# EAGLE design board (EAGLE 9.6.0)
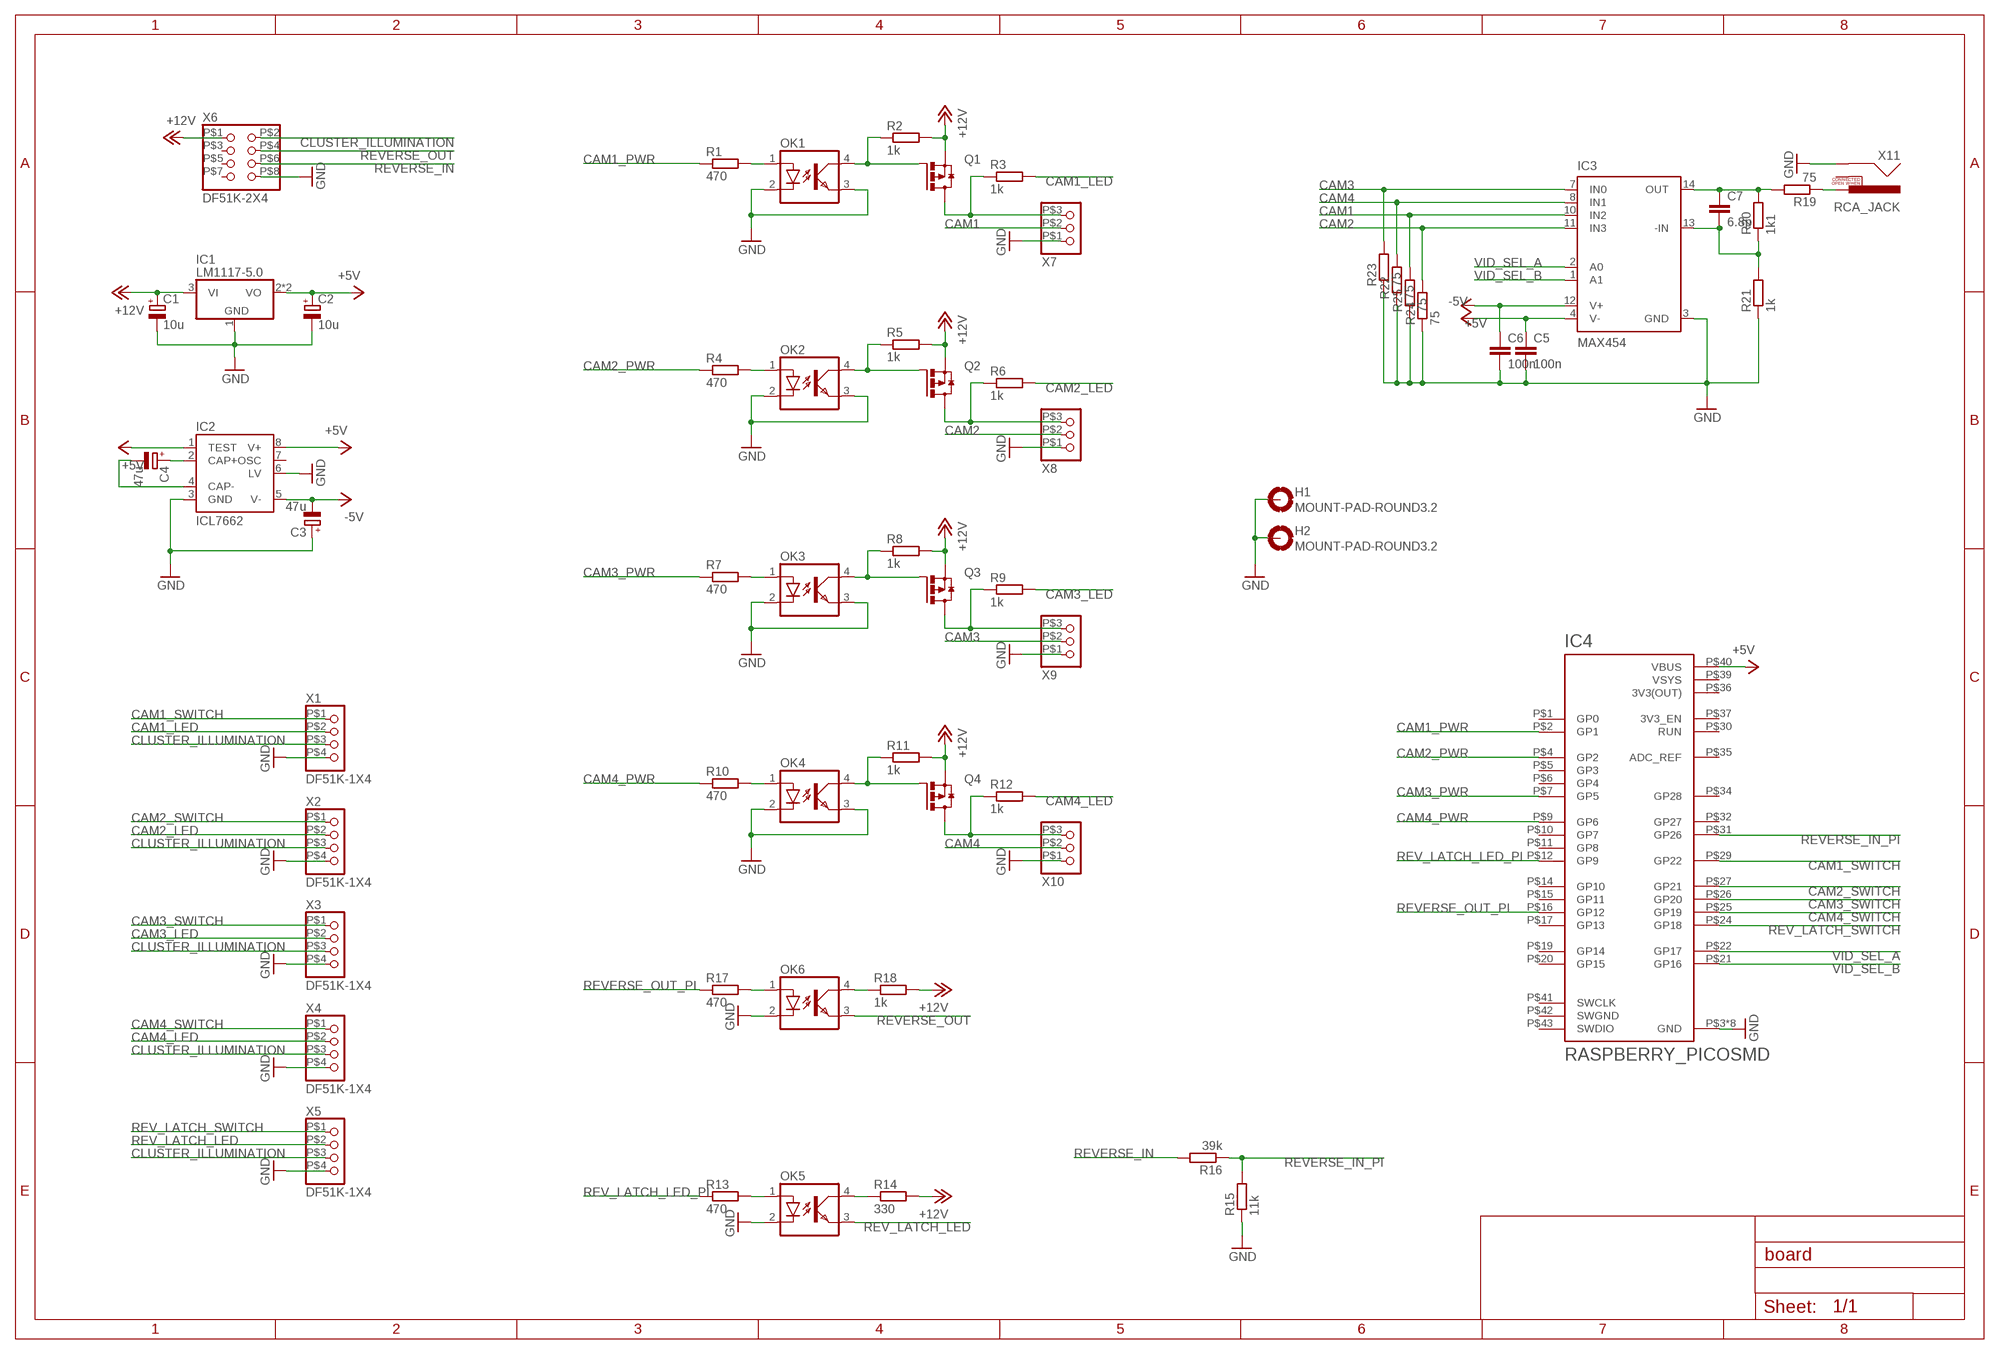
[diagram p0: schematic, sheet 1]

## Parts
C1  10u  CAPACITOR_POL4MM^2  [C_4MM]
C2  10u  CAPACITOR_POL4MM^2  [C_4MM]
C3  47u  CAPACITOR_POL2917  [CT7343]
C4  47u  CAPACITOR_POL2917  [CT7343]
C5  100n  CAPACITOR0805  [C0805]
C6  100n  CAPACITOR0805  [C0805]
C7  6.8p  CAPACITOR0805  [C0805]
H1  MOUNT-PAD-ROUND3.2  [3,2-PAD]
H2  MOUNT-PAD-ROUND3.2  [3,2-PAD]
IC1  LM1117-5.0  LM1117-3.3  [SOT223]
IC2  ICL7662  [SO08]
IC3  MAX454  [DIL14]
IC4  RASPBERRY_PICOSMD  [PICO-PKG-SMD]
OK1  OPTOCOUPLERSO4  [SO04]
OK2  OPTOCOUPLERSO4  [SO04]
OK3  OPTOCOUPLERSO4  [SO04]
OK4  OPTOCOUPLERSO4  [SO04]
OK5  OPTOCOUPLERSO4  [SO04]
OK6  OPTOCOUPLERSO4  [SO04]
Q1  MOSFET_P_CHANNELSOT23  [SOT23]
Q2  MOSFET_P_CHANNELSOT23  [SOT23]
Q3  MOSFET_P_CHANNELSOT23  [SOT23]
Q4  MOSFET_P_CHANNELSOT23  [SOT23]
R1  470  RESISTOR0805  [R0805]
R2  1k  RESISTOR0805  [R0805]
R3  1k  RESISTOR0805  [R0805]
R4  470  RESISTOR0805  [R0805]
R5  1k  RESISTOR0805  [R0805]
R6  1k  RESISTOR0805  [R0805]
R7  470  RESISTOR0805  [R0805]
R8  1k  RESISTOR0805  [R0805]
R9  1k  RESISTOR0805  [R0805]
R10  470  RESISTOR0805  [R0805]
R11  1k  RESISTOR0805  [R0805]
R12  1k  RESISTOR0805  [R0805]
R13  470  RESISTOR0805  [R0805]
R14  330  RESISTOR0805  [R0805]
R15  11k  RESISTOR0805  [R0805]
R16  39k  RESISTOR0805  [R0805]
R17  470  RESISTOR0805  [R0805]
R18  1k  RESISTOR0805  [R0805]
R19  75  RESISTOR0805  [R0805]
R20  1k1  RESISTOR0805  [R0805]
R21  1k  RESISTOR0805  [R0805]
R22  75  RESISTOR0805  [R0805]
R23  75  RESISTOR0805  [R0805]
R24  75  RESISTOR0805  [R0805]
R25  75  RESISTOR0805  [R0805]
X1  DF51K-1X4  [DF51K-1X4]
X2  DF51K-1X4  [DF51K-1X4]
X3  DF51K-1X4  [DF51K-1X4]
X4  DF51K-1X4  [DF51K-1X4]
X5  DF51K-1X4  [DF51K-1X4]
X6  DF51K-2X4  [DF51K-2X4]
X7  JST_XH_1X3  [JST_XH_1X3]
X8  JST_XH_1X3  [JST_XH_1X3]
X9  JST_XH_1X3  [JST_XH_1X3]
X10  JST_XH_1X3  [JST_XH_1X3]
X11  RCA_JACK  [RCA_JACK]

## Nets
+5V: C2.+ C6.1 IC1.2(VO) IC1.4(VO) IC2.1(TEST) IC2.8(V+) IC3.12(V+) IC4.P$40(VBUS)
+12V: C1.+ IC1.3(VI) Q1.2(S) Q2.2(S) Q3.2(S) Q4.2(S) R2.2 R5.2 R8.2 R11.2 R14.2 R18.2 X6.P$1
-5V: C3.- C5.1 IC2.5(V-) IC3.4(V-)
CAM1: IC3.10(IN2) R25.2 X7.P$2
CAM1_LED: R3.2 X1.P$2
CAM1_PWR: IC4.P$2(GP1) R1.1
CAM1_SWITCH: IC4.P$29(GP22) X1.P$1
CAM2: IC3.11(IN3) R24.2 X8.P$2
CAM2_LED: R6.2 X2.P$2
CAM2_PWR: IC4.P$4(GP2) R4.1
CAM2_SWITCH: IC4.P$27(GP21) X2.P$1
CAM3: IC3.7(IN0) R23.2 X9.P$2
CAM3_LED: R9.2 X3.P$2
CAM3_PWR: IC4.P$7(GP5) R7.1
CAM3_SWITCH: IC4.P$26(GP20) X3.P$1
CAM4: IC3.8(IN1) R22.2 X10.P$2
CAM4_LED: R12.2 X4.P$2
CAM4_PWR: IC4.P$9(GP6) R10.1
CAM4_SWITCH: IC4.P$25(GP19) X4.P$1
CLUSTER_ILLUMINATION: X1.P$3 X2.P$3 X3.P$3 X4.P$3 X5.P$3 X6.P$2
GND: C1.- C2.- C3.+ C5.2 C6.2 H1.B3,2(MOUNT) H1.P$1(MOUNT) H1.P$2(MOUNT) H1.P$3(MOUNT) H1.P$4(MOUNT) H1.P$5(MOUNT) H1.P$6(MOUNT) H1.P$7(MOUNT) H1.P$8(MOUNT) H2.B3,2(MOUNT) H2.P$1(MOUNT) H2.P$2(MOUNT) H2.P$3(MOUNT) H2.P$4(MOUNT) H2.P$5(MOUNT) H2.P$6(MOUNT) H2.P$7(MOUNT) H2.P$8(MOUNT) IC1.1(GND) IC2.3(GND) IC2.6(LV) IC3.3(GND) IC4.P$3(GND) IC4.P$8(GND) IC4.P$13(GND) IC4.P$18(GND) IC4.P$23(GND) IC4.P$28(GND) IC4.P$33(GND) IC4.P$38(GND) OK1.2(C) OK1.3(EMIT) OK2.2(C) OK2.3(EMIT) OK3.2(C) OK3.3(EMIT) OK4.2(C) OK4.3(EMIT) OK5.2(C) OK6.2(C) R15.1 R21.1 R22.1 R23.1 R24.1 R25.1 X1.P$4 X2.P$4 X3.P$4 X4.P$4 X5.P$4 X6.P$8 X7.P$1 X8.P$1 X9.P$1 X10.P$1 X11.1(SHELL)
N$1: C4.+ IC2.2(CAP+)
N$2: C4.- IC2.4(CAP-)
N$3: OK1.1(A) R1.2
N$4: OK1.4(COL) Q1.1(G) R2.1
N$5: Q1.3(D) R3.1 X7.P$3
N$6: OK2.1(A) R4.2
N$7: OK2.4(COL) Q2.1(G) R5.1
N$8: Q2.3(D) R6.1 X8.P$3
N$9: OK3.1(A) R7.2
N$10: OK3.4(COL) Q3.1(G) R8.1
N$11: Q3.3(D) R9.1 X9.P$3
N$12: OK4.1(A) R10.2
N$13: C7.1 IC3.14(OUT) R19.2 R20.2
N$14: R19.1 X11.3(PIN)
N$15: C7.2 IC3.13(-IN) R20.1 R21.2
N$16: OK4.4(COL) Q4.1(G) R11.1
N$17: Q4.3(D) R12.1 X10.P$3
N$18: OK6.1(A) R17.2
N$19: OK6.4(COL) R18.1
N$20: OK5.1(A) R13.2
N$21: OK5.4(COL) R14.1
REV_LATCH_LED: OK5.3(EMIT) X5.P$2
REV_LATCH_LED_PI: IC4.P$12(GP9) R13.1
REV_LATCH_SWITCH: IC4.P$24(GP18) X5.P$1
REVERSE_IN: R16.2 X6.P$6
REVERSE_IN_PI: IC4.P$31(GP26) R15.2 R16.1
REVERSE_OUT: OK6.3(EMIT) X6.P$4
REVERSE_OUT_PI: IC4.P$16(GP12) R17.1
VID_SEL_A: IC3.2(A0) IC4.P$22(GP17)
VID_SEL_B: IC3.1(A1) IC4.P$21(GP16)
Unconnected: IC2.7(OSC) IC4.P$1(GP0) IC4.P$5(GP3) IC4.P$6(GP4) IC4.P$10(GP7) IC4.P$11(GP8) IC4.P$14(GP10) IC4.P$15(GP11) IC4.P$17(GP13) IC4.P$19(GP14) IC4.P$20(GP15) IC4.P$30(RUN) IC4.P$32(GP27) IC4.P$34(GP28) IC4.P$35(ADC_REF) IC4.P$37(3V3_EN) IC4.P$41(SWCLK) IC4.P$43(SWDIO) X6.P$3 X6.P$5 X6.P$7 X11.4(SWITCH)

## Power pins joined to a net without a drawn wire
3V3(OUT): IC4.P$36(3V3(OUT))
SWGND: IC4.P$42(SWGND)
VSYS: IC4.P$39(VSYS)

## Library data of the parts
C1-C4 = SMD:CAPACITOR_POL
C5-C7 = SMD:CAPACITOR
H1 H2 = THT:MOUNT-PAD-ROUND: MOUNTING PAD, round
IC1 = SMD:LM1117-3.3
IC2 = SMD:ICL7662
IC3 = THT:MAX454
IC4 = SMD:RASPBERRY_PICO: Raspberry Pi Pico
OK1-OK6 = SMD:OPTOCOUPLER
Q1-Q4 = SMD:MOSFET_P_CHANNEL
R1-R25 = SMD:RESISTOR
X1-X5 = THT:DF51K-1X4
X6 = THT:DF51K-2X4
X7-X10 = THT:JST_XH_1X3
X11 = THT:RCA_JACK

## Board
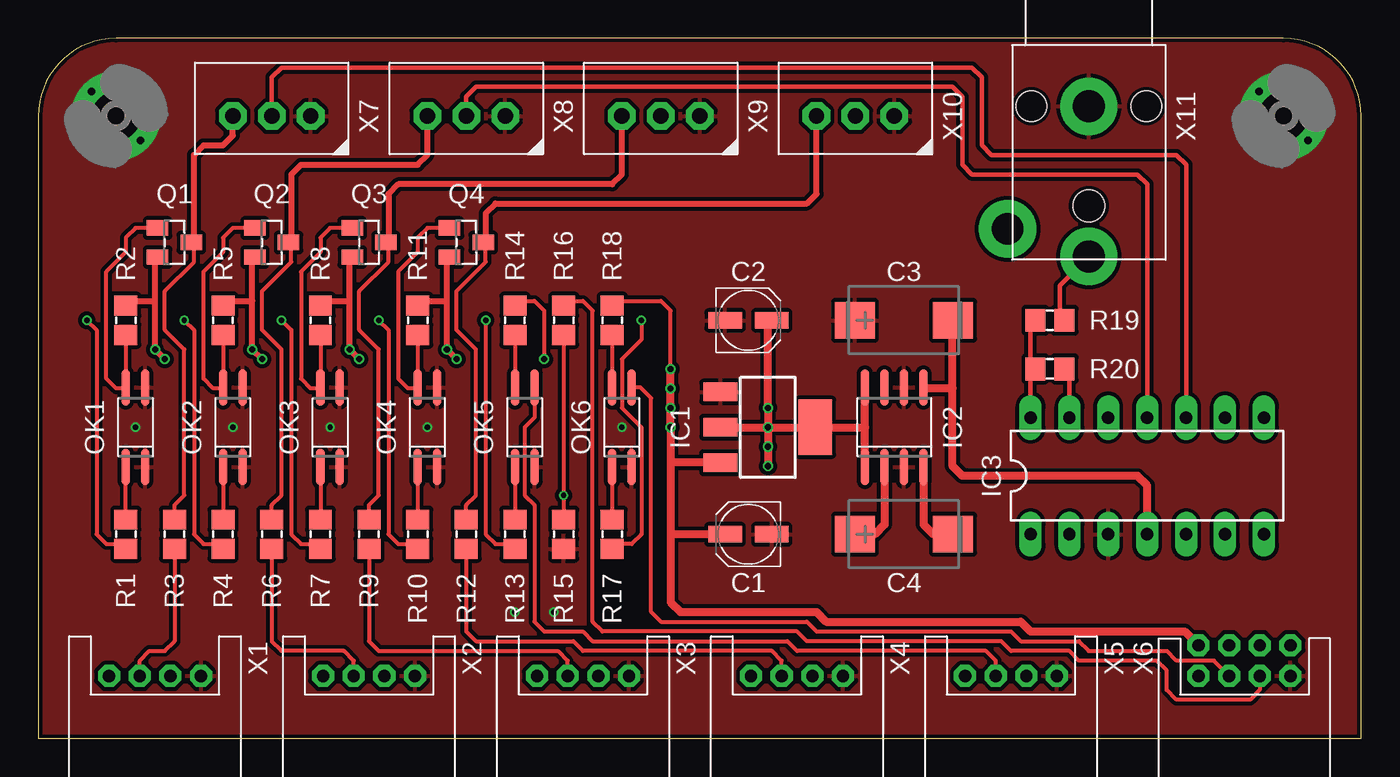
[diagram p1: board, top side]
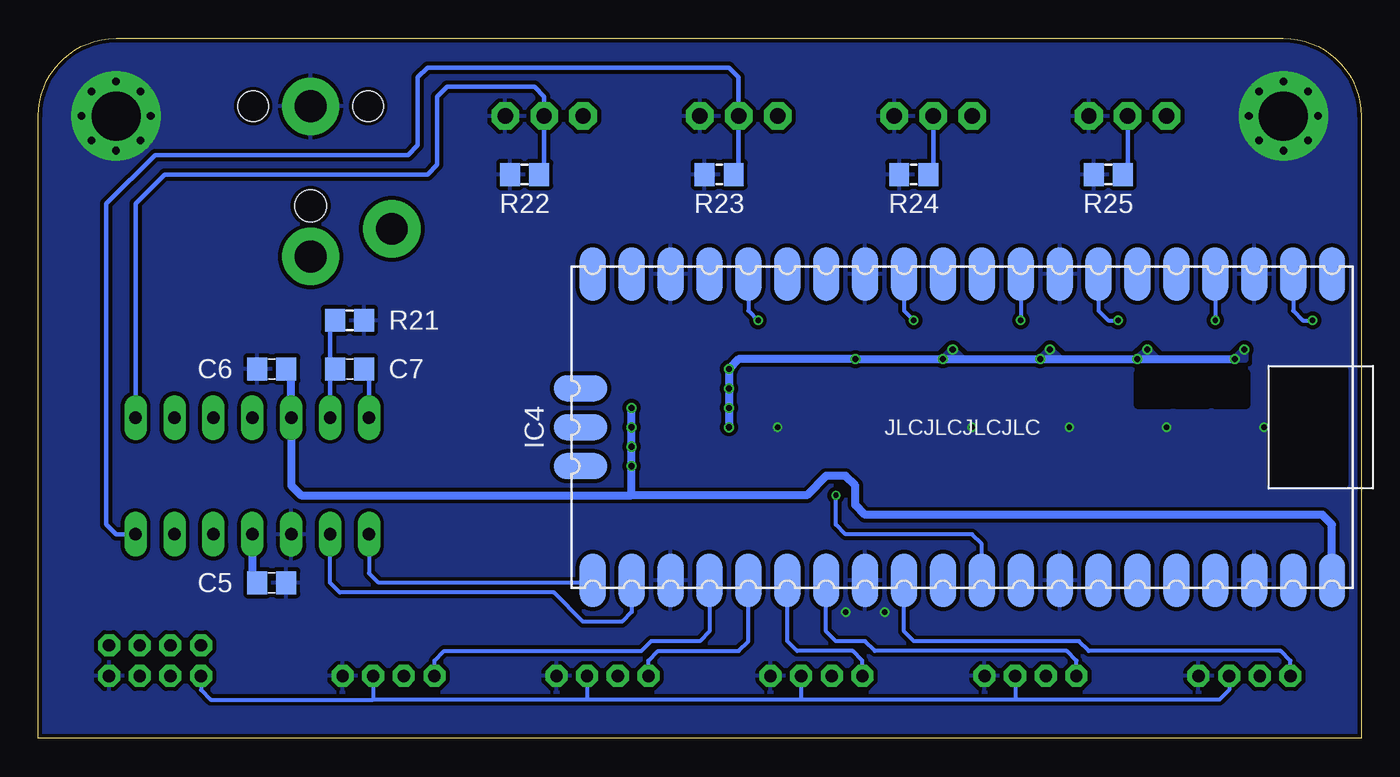
[diagram p2: board, bottom side, seen from below]

Size 86.36 x 45.72 mm. Coordinates in mm from the lower left corner, seen from the top.
Outline: 0,0 86.36,0 86.36,40.64 arc90 81.28,45.72 5.08,45.72 arc90 0,40.64 0,0
Copper layers (1*16): Top 0.035mm / dielectric 1.6mm / Bottom 0.035mm
Design rules "jlc *": minimum track width 6mil, minimum drill 0.3mm, track to track 6mil, track to pad 6mil, pad to pad 6mil, via to via 6mil, smd to smd 6mil, copper to edge 0.2mm, drill to drill 6mil, minimum pad ring 10mil, minimum via ring 5mil, stop-mask expansion 4mil, vias tented up to drill 20mil, thermal gap 10mil

### Footprints (pad centres in the part's own frame; a part is rotated, then mirrored left to right if it is on the bottom)
C_4MM = smd 2.184 x 1.067: + 1.524,0; - -1.524,0
CT7343 = smd 2.6 x 2.4: + -3.2,0; - 3.2,0
C0805 = smd 1.3 x 1.5: 1 -0.95,0; 2 0.95,0
3,2-PAD = drill 3.2 pad 5.842: B3,2 0,0 | drill 0.5: P$1 0,2.261; P$2 0,-2.261; P$3 2.261,0; P$4 -2.261,0; P$5 -1.598,1.598; P$6 1.598,1.598; P$7 -1.598,-1.598; P$8 1.598,-1.598
SOT223 = smd 1.219 x 2.235: 1 -2.311,-3.099; 2 0,-3.099; 3 2.311,-3.099 | smd 3.6 x 2.2: 4 0,3.099
SO08 = smd 0.559 x 2.388: 1 -1.905,-2.6; 2 -0.635,-2.6; 3 0.635,-2.6; 4 1.905,-2.6; 5 1.905,2.6; 6 0.635,2.6; 7 -0.635,2.6; 8 -1.905,2.6
DIL14 = drill 0.813 long: 1 -7.62,-3.81; 2 -5.08,-3.81; 3 -2.54,-3.81; 4 0,-3.81; 5 2.54,-3.81; 6 5.08,-3.81; 7 7.62,-3.81; 8 7.62,3.81; 9 5.08,3.81; 10 2.54,3.81; 11 0,3.81; 12 -2.54,3.81; 13 -5.08,3.81; 14 -7.62,3.81
PICO-PKG-SMD = smd 3.5 x 1.7: P$1 -10,24.13; P$2 -10,21.59; P$3 -10,19.05; P$4 -10,16.51; P$5 -10,13.97; P$6 -10,11.43; P$7 -10,8.89; P$8 -10,6.35; P$9 -10,3.81; P$10 -10,1.27; P$11 -10,-1.27; P$12 -10,-3.81; P$13 -10,-6.35; P$14 -10,-8.89; P$15 -10,-11.43; P$16 -10,-13.97; P$17 -10,-16.51; P$18 -10,-19.05; P$19 -10,-21.59; P$20 -10,-24.13; P$21 10,-24.13; P$22 10,-21.59; P$23 10,-19.05; P$24 10,-16.51; P$25 10,-13.97; P$26 10,-11.43; P$27 10,-8.89; P$28 10,-6.35; P$29 10,-3.81; P$30 10,-1.27; P$31 10,1.27; P$32 10,3.81; P$33 10,6.35; P$34 10,8.89; P$35 10,11.43; P$36 10,13.97; P$37 10,16.51; P$38 10,19.05; P$39 10,21.59; P$40 10,24.13 | smd 1.7 x 3.5: P$41 -2.54,-24.925; P$42 0,-24.925; P$43 2.54,-24.925
SO04 = smd 0.559 x 2.388: 1 -0.635,-2.6; 2 0.635,-2.6; 3 0.635,2.6; 4 -0.635,2.6
SOT23 = smd 1 x 1.4: 1 -0.95,-1.1; 2 0.95,-1.1; 3 0,1.1
R0805 = smd 1.3 x 1.5: 1 -0.95,0; 2 0.95,0
DF51K-1X4 = drill 0.8 octagon: P$1 -3,0; P$2 -1,0; P$3 1,0; P$4 3,0
DF51K-2X4 = drill 0.8 octagon: P$1 -3,1; P$2 -3,-1; P$3 -1,1; P$4 -1,-1; P$5 1,1; P$6 1,-1; P$7 3,1; P$8 3,-1
JST_XH_1X3 = drill 1 octagon: P$1 -2.54,0; P$2 0,0; P$3 2.54,0
RCA_JACK = drill 2.08: 1 0,0; 3 9.8,0; 4 8,-5.3 | hole 2.08: 6.5,0 | hole 1.98: 0,3.745; 0,-3.745

### Placement (x,y rotation side)
C1  46.35,13.34 180 top
C2  46.35,27.3 0 top
C3  56.52,27.3 0 top
C4  56.52,13.34 0 top
C5  71.12,10.16 0 bottom
C6  71.12,24.13 180 bottom
C7  66.04,24.13 180 bottom
H1  5.08,40.64 0 top
H2  81.28,40.64 0 top
IC1  47.62,20.32 270 top
IC2  55.88,20.32 0 top
IC3  72.39,17.14 0 top
IC4  26.04,20.32 270 bottom
OK1  6.35,20.32 0 top
OK2  12.7,20.32 0 top
OK3  19.05,20.32 0 top
OK4  25.4,20.32 0 top
OK5  31.75,20.32 0 top
OK6  38.1,20.32 0 top
Q1  8.89,32.38 270 top
Q2  15.24,32.38 270 top
Q3  21.59,32.38 270 top
Q4  27.94,32.38 270 top
R1  5.71,13.34 90 top
R2  5.71,27.3 90 top
R3  8.89,13.34 270 top
R4  12.06,13.34 90 top
R5  12.06,27.3 90 top
R6  15.24,13.34 270 top
R7  18.41,13.34 90 top
R8  18.41,27.3 90 top
R9  21.59,13.34 270 top
R10  24.77,13.34 90 top
R11  24.77,27.3 90 top
R12  27.94,13.34 270 top
R13  31.11,13.34 90 top
R14  31.11,27.3 90 top
R15  34.29,13.34 90 top
R16  34.29,27.3 90 top
R17  37.47,13.34 90 top
R18  37.47,27.3 90 top
R19  66.04,27.3 180 top
R20  66.04,24.13 180 top
R21  66.04,27.3 180 bottom
R22  54.61,36.83 0 bottom
R23  41.91,36.83 0 bottom
R24  29.21,36.83 0 bottom
R25  16.51,36.83 0 bottom
X1  7.62,4.08 0 top
X2  21.59,4.08 0 top
X3  35.56,4.08 0 top
X4  49.53,4.08 0 top
X5  63.5,4.08 0 top
X6  78.74,5.08 0 top
X7  15.24,40.64 180 top
X8  27.94,40.64 180 top
X9  40.64,40.64 180 top
X10  53.34,40.64 180 top
X11  68.58,41.27 270 top

### Tracks (layer width: path | path; a pad name or v marks a point on that pad's centre or on a via)
+5V  (via drill 0.4)
  Top 0.508: C2.+ 47.62,27.05 v47.62,21.59 v47.62,20.32 | IC1.2 v47.62,20.32 | v47.62,20.32 IC1.4 53.98,20.32 | v47.62,20.32 v47.62,19.05 v47.62,17.78 | 53.98,20.32 IC2.8 | IC2.1 53.98,20.32
  Bottom 0.508: IC4.P$40 1.91,13.97 2.54,14.61 32.38,14.61 33.02,15.24 33.02,16.51 33.66,17.14 34.92,17.14 36.2,15.88 47.62,15.88 | 47.62,15.88 v47.62,21.59 | C6.1 69.85,23.81 IC3.12 69.85,16.51 69.22,15.88 47.62,15.88
+12V  (via drill 0.4)
  Top 0.254: R18.2 37.78,28.25 38.1,28.57 40.64,28.57 41.27,27.94 v41.27,24.13 | R14.2 31.43,28.57 32.38,28.57 33.02,27.94 v33.02,24.77
  Top 0.406: Q4.2 26.67,31.27 26.67,28.57 | v27.3,24.77 v26.67,25.4 26.67,28.57 | R11.2 25.08,28.25 25.4,28.57 26.67,28.57 | Q3.2 20.32,31.27 20.32,28.57 | v20.95,24.77 v20.32,25.4 20.32,28.57 | R8.2 18.73,28.57 20.32,28.57 | Q2.2 13.97,31.27 13.97,28.57 | v14.61,24.77 v13.97,25.4 13.97,28.57 | R5.2 12.38,28.57 13.97,28.57 | Q1.2 7.62,31.27 7.62,28.57 | R2.2 6.04,28.57 7.62,28.57 | 7.62,28.57 v7.62,25.4 v8.26,24.77
  Top 0.508: X6.P$1 74.83,6.99 64.77,6.99 64.14,7.62 51.44,7.62 50.8,8.26 41.91,8.26 41.27,8.89 41.27,13.34 | v41.27,24.13 v41.27,22.86 v41.27,21.59 v41.27,20.32 41.27,18.01 | 41.27,18.01 41.27,13.34 | IC1.3 41.27,18.01 | C1.+ 41.27,13.34
  Bottom 0.508: v8.26,24.77 v14.61,24.77 v20.95,24.77 v27.3,24.77 v33.02,24.77 40.64,24.77 v41.27,24.13 v41.27,22.86 v41.27,21.59 v41.27,20.32
  pour Bottom (isolate 0.254): 7.62,25.4 7.62,24.77 8.26,24.77
  pour Bottom (isolate 0.254): 13.34,24.77 13.97,25.4 14.61,24.77
  pour Bottom (isolate 0.254): 19.68,24.77 20.32,25.4 20.95,24.77
  pour Bottom (isolate 0.254): 26.04,24.77 26.67,25.4 27.3,24.77
-5V
  Top 0.508: IC3.4 72.39,16.51 71.75,17.14 60.33,17.14 59.69,17.78 59.69,22.86 | C3.- 59.69,27.28 59.69,22.86 | IC2.5 57.84,22.86 59.69,22.86
  Bottom 0.254: 72.39,10.48 C5.1
  Bottom 0.508: IC3.4 72.39,10.48
CAM1
  Top 0.305: X7.P$2 15.24,43.18 15.88,43.81 60.96,43.81 61.59,43.18 61.59,38.73 62.23,38.1 74.3,38.1 74.93,37.47 IC3.10
  Bottom 0.254: 15.24,37.15 R25.2
  Bottom 0.305: X7.P$2 15.24,37.15
CAM1_LED
  Top 0.254: R3.2 8.89,6.35 8.26,5.71 7.25,5.71 6.62,5.08 X1.P$2
CAM1_PWR  (via drill 0.35)
  Top 0.254: v3.17,27.3 3.81,26.67 3.81,13.34 4.45,12.7 6.03,12.7 R1.1
  Bottom 0.254: IC4.P$2 4.45,27.94 3.81,27.3 v3.17,27.3
CAM1_SWITCH
  Bottom 0.254: X1.P$1 4.62,5.08 5.25,5.71 17.78,5.71 18.41,6.35 29.21,6.35 29.84,6.99 IC4.P$29
CAM2
  Top 0.305: X8.P$2 27.94,41.91 28.57,42.55 59.69,42.55 60.33,41.91 60.33,37.47 60.96,36.83 71.75,36.83 72.39,36.2 IC3.11
  Bottom 0.254: 27.94,37.15 R24.2
  Bottom 0.305: X8.P$2 27.94,37.15
CAM2_LED
  Top 0.254: R6.2 15.24,6.35 15.88,5.71 19.95,5.71 20.59,5.08 X2.P$2
CAM2_PWR  (via drill 0.35)
  Top 0.254: v9.53,27.3 10.16,26.67 10.16,13.34 10.79,12.7 12.38,12.7 R4.1
  Bottom 0.254: IC4.P$4 v9.53,27.3
CAM2_SWITCH
  Bottom 0.254: X2.P$1 18.59,5.08 19.23,5.71 31.75,5.71 32.38,6.35 34.29,6.35 34.92,6.99 IC4.P$27
CAM3
  Bottom 0.254: 40.64,36.83 R23.2
  Bottom 0.305: 40.64,36.83 X9.P$2 40.64,43.18 41.27,43.81 60.96,43.81 61.59,43.18 61.59,38.73 62.23,38.1 78.74,38.1 81.92,34.92 81.92,13.97 81.28,13.34 IC3.7
CAM3_LED
  Top 0.254: X3.P$2 34.56,5.08 33.92,5.71 22.23,5.71 21.59,6.35 R9.2
CAM3_PWR  (via drill 0.35)
  Top 0.254: v15.88,27.3 16.51,26.67 16.51,13.34 17.14,12.7 18.73,12.7 R7.1
  Bottom 0.254: IC4.P$7 17.14,27.94 16.51,27.3 v15.88,27.3
CAM3_SWITCH
  Bottom 0.254: X3.P$1 32.56,5.08 33.2,5.71 36.83,5.71 37.47,6.35 IC4.P$26
CAM4
  Bottom 0.254: 53.34,36.83 R22.2
  Bottom 0.305: IC3.8 80.01,34.92 78.11,36.83 60.96,36.83 60.33,37.47 60.33,41.91 59.69,42.55 53.98,42.55 53.34,41.91 X10.P$2 53.34,36.83
CAM4_LED
  Top 0.254: R12.2 27.94,6.99 28.57,6.35 34.92,6.35 35.56,5.71 47.9,5.71 48.53,5.08 X4.P$2
CAM4_PWR  (via drill 0.35)
  Top 0.254: v22.23,27.3 22.86,26.67 22.86,13.34 23.5,12.7 25.08,12.7 R10.1
  Bottom 0.254: IC4.P$9 v22.23,27.3
CAM4_SWITCH
  Bottom 0.254: X4.P$1 46.53,5.08 45.9,5.71 40.64,5.71 40.01,6.35 IC4.P$25
CLUSTER_ILLUMINATION
  Bottom 0.254: X1.P$3 8.62,3.17 9.26,2.54 22.59,2.54 | 22.59,2.54 36.56,2.54 | 36.56,2.54 50.53,2.54 | 50.53,2.54 64.5,2.54 | X5.P$3 64.5,2.54 | X4.P$3 50.53,2.54 | X3.P$3 36.56,2.54 | X2.P$3 22.59,2.54 | X6.P$2 75.74,3.17 75.11,2.54 64.5,2.54
GND  (via drill 0.35)
  other vias: 6.35,20.32 12.7,20.32 19.05,20.32 25.4,20.32 38.1,20.32 33.66,8.26 31.11,8.26
  pour Top (isolate 0.254): 0,0 0,40.64 arc-90 5.08,45.72 81.28,45.72 arc-90 86.36,40.64 86.36,0
  pour Bottom (isolate 0.254, rank 2): 0,0 0,40.64 arc-90 5.08,45.72 81.28,45.72 arc-90 86.36,40.64 86.36,0
N$1
  Top 0.508: IC2.2 55.24,13.97 54.61,13.34 C4.+
N$2
  Top 0.508: IC2.4 57.78,13.97 58.42,13.34 C4.-
N$3
  Top 0.254: R1.2 OK1.1
N$4
  Top 0.254: R2.1 OK1.4 5.66,22.86 5.08,22.86 4.45,23.5 4.45,30.48 5.71,31.75 5.71,32.7 6.35,33.34 Q1.1
N$5
  Top 0.254: R3.1 8.89,15.24 9.53,15.88 9.53,25.4 8.26,26.67 8.26,29.21 10.16,31.11 10.16,32.22 Q1.3
  Top 0.406: Q1.3 10.16,32.55 10.16,38.1 10.79,38.73 12.06,38.73 12.7,39.37 X7.P$3
N$6
  Top 0.254: OK2.1 R4.2
N$7
  Top 0.254: R5.1 OK2.4 12.01,22.86 11.43,22.86 10.79,23.5 10.79,30.48 12.06,31.75 12.06,32.7 12.7,33.34 Q2.1
N$8
  Top 0.254: R6.1 15.24,15.24 15.88,15.88 15.88,25.4 14.61,26.67 14.61,29.21 16.51,31.11 16.51,32.38 16.43,32.47
  Top 0.406: X8.P$3 25.4,38.1 24.77,37.47 17.14,37.47 16.51,36.83 16.51,32.55 16.43,32.47 Q2.3
N$9
  Top 0.254: OK3.1 R7.2
N$10
  Top 0.254: R8.1 OK3.4 18.36,22.86 17.78,22.86 17.14,23.5 17.14,30.48 18.41,31.75 18.41,32.7 19.05,33.34 Q3.1
N$11
  Top 0.254: R9.1 21.59,15.24 22.23,15.88 22.23,25.4 20.95,26.67 20.95,29.21 22.86,31.11 22.86,32.22 Q3.3
  Top 0.406: X9.P$3 38.1,36.83 37.47,36.2 23.5,36.2 22.86,35.56 22.86,32.55 Q3.3
N$12
  Top 0.254: OK4.1 R10.2
N$13
  Top 0.254: 64.77,23.81 R20.2 64.77,24.45 | 64.77,26.98 R19.2
  Top 0.305: IC3.14 64.77,23.81 | 64.77,24.45 64.77,26.98
  Bottom 0.254: 64.77,23.81 R20.2
  Bottom 0.305: IC3.14 64.77,23.81
N$14
  Top 0.254: 66.67,27.62 R19.1
  Top 0.305: X11.3 66.67,29.57 66.67,27.62
N$15
  Top 0.254: 67.31,23.81 C7.2
  Top 0.305: IC3.13 67.31,23.81
  Bottom 0.254: 67.31,24.13 C7.2 | R21.2 67.31,26.98
  Bottom 0.305: IC3.13 67.31,24.13 67.31,26.98
N$16
  Top 0.254: R11.1 OK4.4 24.7,22.86 24.13,22.86 23.5,23.5 23.5,30.48 24.77,31.75 24.77,32.7 25.4,33.34 Q4.1
N$17
  Top 0.254: R12.1 27.94,15.24 28.57,15.88 28.57,25.4 27.3,26.67 27.3,29.21 29.21,31.11 29.21,32.22 Q4.3
  Top 0.406: X10.P$3 50.8,35.56 50.16,34.92 29.84,34.92 29.21,34.29 29.21,32.55 Q4.3
N$18
  Top 0.254: OK6.1 R17.2
N$19
  Top 0.254: R18.1 OK6.4
N$20
  Top 0.254: OK5.1 R13.2
N$21
  Top 0.254: R14.1 OK5.4
REV_LATCH_LED
  Top 0.254: OK5.3 32.38,20.95 31.75,20.32 31.75,15.88 32.38,15.24 32.38,7.62 33.02,6.99 35.56,6.99 36.2,6.35 48.9,6.35 49.53,5.71 61.87,5.71 62.5,5.08 X5.P$2
REV_LATCH_LED_PI  (via drill 0.35)
  Top 0.254: v29.21,27.3 29.21,13.34 29.84,12.7 30.8,12.7 R13.1
  Bottom 0.254: IC4.P$12 29.84,27.94 v29.21,27.3
REV_LATCH_SWITCH
  Bottom 0.254: IC4.P$24 42.55,6.99 43.18,6.35 46.35,6.35 46.99,5.71 59.87,5.71 60.5,5.08 X5.P$1
REVERSE_IN
  Top 0.254: R16.2 34.6,28.25 34.92,28.57 35.56,28.57 36.2,27.94 36.2,7.62 36.83,6.99 49.53,6.99 50.16,6.35 62.87,6.35 63.5,5.71 67.31,5.71 67.94,5.08 73.03,5.08 73.66,4.45 73.66,3.17 74.3,2.54 79.11,2.54 79.74,3.17 X6.P$6
REVERSE_IN_PI  (via drill 0.35)
  Top 0.254: R16.1 v34.29,15.88 R15.2
  Bottom 0.254: IC4.P$31 24.77,12.7 25.4,13.34 33.66,13.34 34.29,13.97 v34.29,15.88
REVERSE_OUT
  Top 0.254: OK6.3 39.31,22.92 40.01,22.23 40.01,8.26 40.64,7.62 50.16,7.62 50.8,6.99 63.5,6.99 64.14,6.35 67.94,6.35 68.58,5.71 73.66,5.71 74.3,5.08 76.74,5.08 X6.P$4
REVERSE_OUT_PI  (via drill 0.35)
  Top 0.254: v39.37,27.3 39.37,26.04 38.1,24.77 38.1,21.59 39.37,20.32 39.37,13.34 38.73,12.7 37.78,12.7 R17.1
  Bottom 0.254: IC4.P$16 40.01,27.94 v39.37,27.3
VID_SEL_A
  Bottom 0.254: IC4.P$22 47.62,8.26 48.26,7.62 50.8,7.62 52.7,9.53 66.67,9.53 67.31,10.16 IC3.2
VID_SEL_B
  Bottom 0.254: IC3.1 64.77,10.79 64.14,10.16 50.8,10.16 50.64,10.32 IC4.P$21

### Text on the board
bNames: JLCJLCJLCJLC